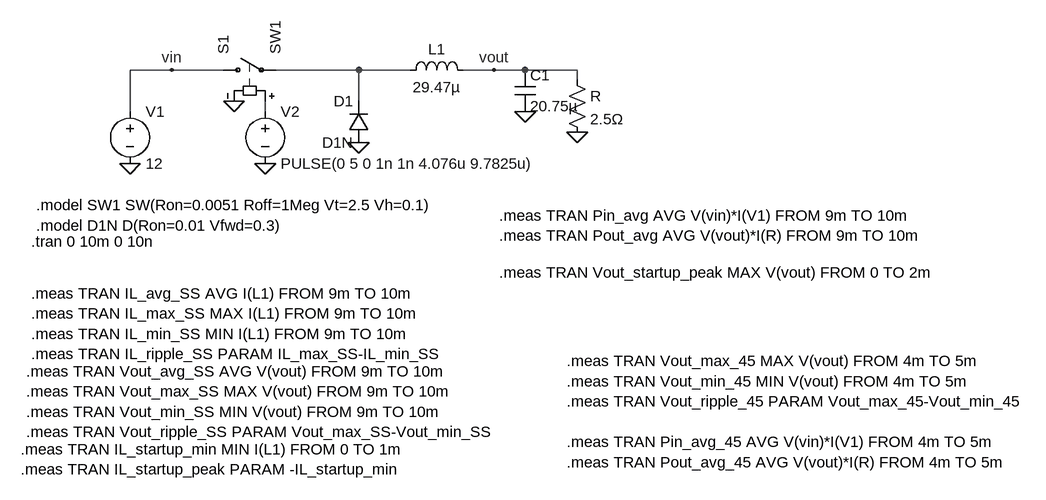
[diagram p0: schematic Draft4_maxEfficiency.asc]
Draft4_maxEfficiency.asc, the LTspice schematic file:
Version 4.1
SHEET 1 1520 680
WIRE 96 32 32 32
WIRE 176 32 96 32
WIRE 384 32 256 32
WIRE 464 32 384 32
WIRE 592 32 544 32
WIRE 640 32 592 32
WIRE 720 32 640 32
WIRE 720 48 720 32
WIRE 384 80 384 32
WIRE 32 96 32 32
WIRE 240 96 240 80
FLAG 32 176 0
FLAG 192 80 0
FLAG 240 176 0
FLAG 384 144 0
FLAG 640 96 0
FLAG 720 128 0
FLAG 592 32 vout
FLAG 96 32 vin
SYMBOL voltage 32 80 R0
WINDOW 123 0 0 Left 0
WINDOW 39 0 0 Left 0
SYMATTR InstName V1
SYMATTR Value 12
SYMBOL sw 160 32 R270
SYMATTR InstName S1
SYMATTR Value SW1
SYMBOL voltage 240 80 R0
WINDOW 123 0 0 Left 0
WINDOW 39 0 0 Left 0
SYMATTR InstName V2
SYMATTR Value PULSE(0 5 0 1n 1n 4.076u 9.7825u)
SYMBOL diode 400 144 R180
WINDOW 0 24 64 Left 2
WINDOW 3 24 0 Left 2
SYMATTR InstName D1
SYMATTR Value D1N
SYMBOL ind 560 48 M270
WINDOW 0 32 56 VTop 2
WINDOW 3 5 56 VBottom 2
SYMATTR InstName L1
SYMATTR Value 29.47µ
SYMATTR SpiceLine Rser=1m
SYMBOL cap 624 32 R0
SYMATTR InstName C1
SYMATTR Value 20.75µ
SYMBOL res 704 32 R0
SYMATTR InstName R
SYMATTR Value 2.5Ω
TEXT -120 296 Left 2 !.tran 0 10m 0 10n
TEXT -112 240 Left 2 !.model SW1 SW(Ron=0.0051 Roff=1Meg Vt=2.5 Vh=0.1)\n.model D1N D(Ron=0.01 Vfwd=0.3)
TEXT -120 376 Left 2 !.meas TRAN IL_avg_SS AVG I(L1) FROM 9m TO 10m\n.meas TRAN IL_max_SS MAX I(L1) FROM 9m TO 10m\n.meas TRAN IL_min_SS MIN I(L1) FROM 9m TO 10m\n.meas TRAN IL_ripple_SS PARAM IL_max_SS-IL_min_SS
TEXT -128 496 Left 2 !.meas TRAN Vout_avg_SS AVG V(vout) FROM 9m TO 10m\n.meas TRAN Vout_max_SS MAX V(vout) FROM 9m TO 10m\n.meas TRAN Vout_min_SS MIN V(vout) FROM 9m TO 10m\n.meas TRAN Vout_ripple_SS PARAM Vout_max_SS-Vout_min_SS
TEXT 600 256 Left 2 !.meas TRAN Pin_avg AVG V(vin)*I(V1) FROM 9m TO 10m\n.meas TRAN Pout_avg AVG V(vout)*I(R) FROM 9m TO 10m
TEXT -136 616 Left 2 !.meas TRAN IL_startup_min MIN I(L1) FROM 0 TO 1m\n.meas TRAN IL_startup_peak PARAM -IL_startup_min
TEXT 600 344 Left 2 !.meas TRAN Vout_startup_peak MAX V(vout) FROM 0 TO 2m
TEXT 704 480 Left 2 !.meas TRAN Vout_max_45 MAX V(vout) FROM 4m TO 5m\n.meas TRAN Vout_min_45 MIN V(vout) FROM 4m TO 5m\n.meas TRAN Vout_ripple_45 PARAM Vout_max_45-Vout_min_45\n \n.meas TRAN Pin_avg_45 AVG V(vin)*I(V1) FROM 4m TO 5m\n.meas TRAN Pout_avg_45 AVG V(vout)*I(R) FROM 4m TO 5m

The netlist it stands for:
* Draft4_maxEfficiency.asc
V1 vin 0 12
S1 vin N001 N002 0 SW1
V2 N002 0 PULSE(0 5 0 1n 1n 4.076u 9.7825u)
D1 0 N001 D1N
L1 vout N001 29.47µ Rser=1m
C1 vout 0 20.75µ
R vout 0 2.5Ω
.model D D
.lib standard.dio
.tran 0 10m 0 10n
.model SW1 SW(Ron=0.0051 Roff=1Meg Vt=2.5 Vh=0.1)
.model D1N D(Ron=0.01 Vfwd=0.3)
.meas TRAN IL_avg_SS AVG I(L1) FROM 9m TO 10m
.meas TRAN IL_max_SS MAX I(L1) FROM 9m TO 10m
.meas TRAN IL_min_SS MIN I(L1) FROM 9m TO 10m
.meas TRAN IL_ripple_SS PARAM IL_max_SS-IL_min_SS
.meas TRAN Vout_avg_SS AVG V(vout) FROM 9m TO 10m
.meas TRAN Vout_max_SS MAX V(vout) FROM 9m TO 10m
.meas TRAN Vout_min_SS MIN V(vout) FROM 9m TO 10m
.meas TRAN Vout_ripple_SS PARAM Vout_max_SS-Vout_min_SS
.meas TRAN Pin_avg AVG V(vin)*I(V1) FROM 9m TO 10m
.meas TRAN Pout_avg AVG V(vout)*I(R) FROM 9m TO 10m
.meas TRAN IL_startup_min MIN I(L1) FROM 0 TO 1m
.meas TRAN IL_startup_peak PARAM -IL_startup_min
.meas TRAN Vout_startup_peak MAX V(vout) FROM 0 TO 2m
.meas TRAN Vout_max_45 MAX V(vout) FROM 4m TO 5m
.meas TRAN Vout_min_45 MIN V(vout) FROM 4m TO 5m
.meas TRAN Vout_ripple_45 PARAM Vout_max_45-Vout_min_45
.meas TRAN Pin_avg_45 AVG V(vin)*I(V1) FROM 4m TO 5m
.meas TRAN Pout_avg_45 AVG V(vout)*I(R) FROM 4m TO 5m
.backanno
.end